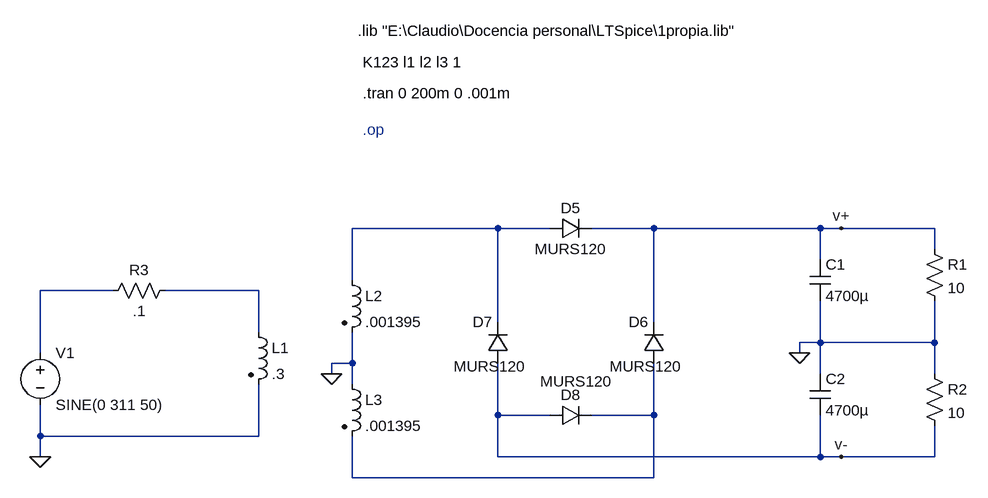
[diagram p0: schematic fuente primaria.asc]
fuente primaria.asc, the LTspice schematic file:
Version 4
SHEET 1 1284 680
WIRE 528 -256 304 -256
WIRE 608 -256 528 -256
WIRE 768 -256 672 -256
WIRE 1024 -256 768 -256
WIRE 1056 -256 1024 -256
WIRE 1200 -256 1056 -256
WIRE 1200 -224 1200 -256
WIRE 1024 -208 1024 -256
WIRE 304 -176 304 -256
WIRE -64 -160 -176 -160
WIRE 160 -160 16 -160
WIRE 528 -112 528 -256
WIRE 768 -112 768 -256
WIRE 160 -96 160 -160
WIRE 1024 -80 1024 -144
WIRE 1024 -80 992 -80
WIRE 1200 -80 1200 -144
WIRE 1200 -80 1024 -80
WIRE -176 -64 -176 -160
WIRE 992 -64 992 -80
WIRE 304 -48 304 -96
WIRE 304 -48 272 -48
WIRE 272 -32 272 -48
WIRE 1024 -32 1024 -80
WIRE 1200 -32 1200 -80
WIRE 304 -16 304 -48
WIRE 528 32 528 -48
WIRE 608 32 528 32
WIRE 768 32 768 -48
WIRE 768 32 672 32
WIRE -176 64 -176 16
WIRE 160 64 160 -16
WIRE 160 64 -176 64
WIRE -176 96 -176 64
WIRE 528 96 528 32
WIRE 1024 96 1024 32
WIRE 1024 96 528 96
WIRE 1056 96 1024 96
WIRE 1200 96 1200 48
WIRE 1200 96 1056 96
WIRE 304 128 304 64
WIRE 768 128 768 32
WIRE 768 128 304 128
FLAG -176 96 0
FLAG 1056 -256 v+
FLAG 1056 96 v-
FLAG 272 -32 0
FLAG 992 -64 0
SYMBOL voltage -176 -80 R0
WINDOW 123 24 44 Left 2
WINDOW 39 0 0 Left 0
SYMATTR InstName V1
SYMATTR Value SINE(0 311 50)
SYMBOL ind2 144 -112 R0
SYMATTR InstName L1
SYMATTR Value .3
SYMBOL ind2 288 -192 R0
SYMATTR InstName L2
SYMATTR Value .001395
SYMBOL ind2 288 -32 R0
SYMATTR InstName L3
SYMATTR Value .001395
SYMBOL res 32 -176 R90
WINDOW 0 0 56 VBottom 2
WINDOW 3 32 56 VTop 2
SYMATTR InstName R3
SYMATTR Value .1
SYMBOL cap 1008 -208 R0
SYMATTR InstName C1
SYMATTR Value 4700µ
SYMBOL cap 1008 -32 R0
SYMATTR InstName C2
SYMATTR Value 4700µ
SYMBOL diode 608 -240 R270
WINDOW 0 32 32 VTop 2
WINDOW 3 0 32 VBottom 2
SYMATTR InstName D5
SYMATTR Value MURS120
SYMBOL diode 784 -48 R180
WINDOW 0 24 64 Left 2
WINDOW 3 -27 -5 Left 2
SYMATTR InstName D6
SYMATTR Value MURS120
SYMBOL diode 544 -48 R180
WINDOW 0 24 64 Left 2
WINDOW 3 -27 -5 Left 2
SYMATTR InstName D7
SYMATTR Value MURS120
SYMBOL diode 608 48 R270
WINDOW 0 32 32 VTop 2
WINDOW 3 84 41 VBottom 2
SYMATTR InstName D8
SYMATTR Value MURS120
SYMBOL res 1184 -240 R0
SYMATTR InstName R1
SYMATTR Value 10
SYMBOL res 1184 -48 R0
SYMATTR InstName R2
SYMATTR Value 10
TEXT 320 -464 Left 2 !.tran 0 200m 0 .001m
TEXT 320 -512 Left 2 !K123 l1 l2 l3 1
TEXT 312 -560 Left 2 !.lib "E:\\Claudio\\Docencia personal\\LTSpice\\1propia.lib"
TEXT 320 -408 Left 2 ;.op

The netlist it stands for:
* fuente primaria.asc
V1 N002 0 SINE(0 311 50)
L1 N003 0 .3
L2 N001 0 .001395
L3 0 N004 .001395
R3 N003 N002 .1
C1 v+ 0 4700µ
C2 0 v- 4700µ
D5 N001 v+ MURS120
D6 N004 v+ MURS120
D7 v- N001 MURS120
D8 v- N004 MURS120
R1 v+ 0 10
R2 0 v- 10
.model D D
.lib standard.dio
.tran 0 200m 0 .001m
K123 l1 l2 l3 1
.lib "E:\Claudio\Docencia personal\LTSpice\1propia.lib"
* .op
.backanno
.end